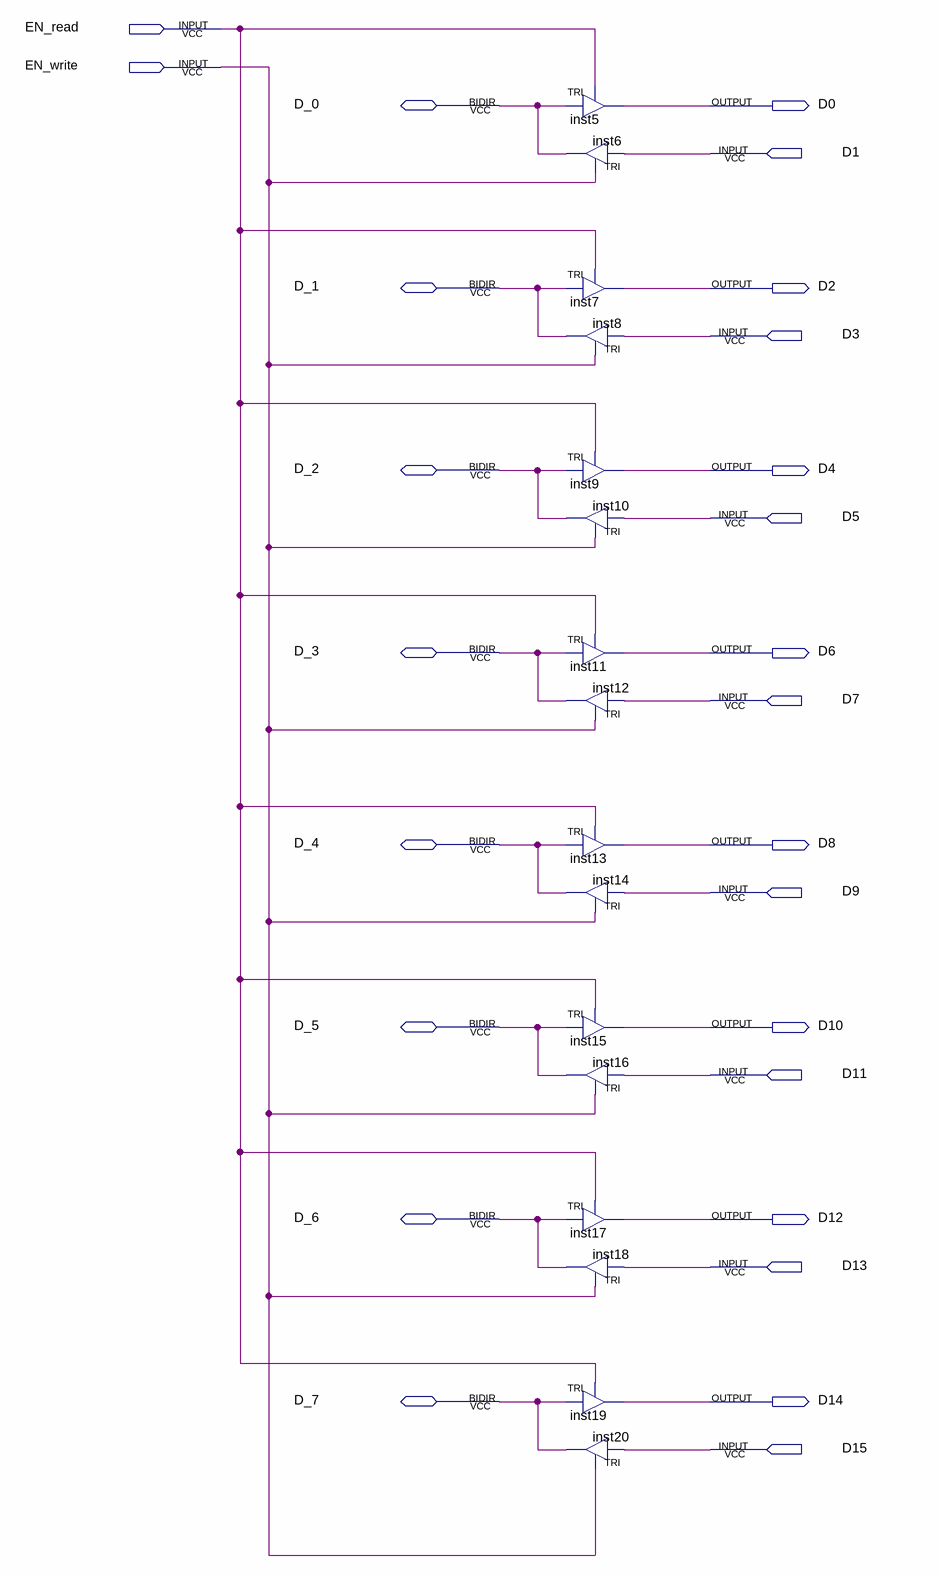
[diagram p0: schematic sheet]
// Quartus schematic santaixuantong.bdf as structural Verilog: 16 symbols, 26 pins
module santaixuantong (
  input  EN_read,
  input  EN_write,
  input  D1,
  input  D3,
  input  D5,
  input  D7,
  input  D9,
  input  D11,
  input  D13,
  input  D15,
  inout  D_0,
  inout  D_1,
  inout  D_2,
  inout  D_3,
  inout  D_4,
  inout  D_5,
  inout  D_6,
  inout  D_7,
  output D0,
  output D2,
  output D4,
  output D6,
  output D8,
  output D10,
  output D12,
  output D14
);

  TRI inst5 (.IN(D_0), .OE(EN_read), .OUT(D0));
  TRI inst6 (.IN(D1), .OE(EN_write), .OUT(D_0));
  TRI inst7 (.IN(D_1), .OE(EN_read), .OUT(D2));
  TRI inst8 (.IN(D3), .OE(EN_write), .OUT(D_1));
  TRI inst9 (.IN(D_2), .OE(EN_read), .OUT(D4));
  TRI inst10 (.IN(D5), .OE(EN_write), .OUT(D_2));
  TRI inst11 (.IN(D_3), .OE(EN_read), .OUT(D6));
  TRI inst12 (.IN(D7), .OE(EN_write), .OUT(D_3));
  TRI inst13 (.IN(D_4), .OE(EN_read), .OUT(D8));
  TRI inst14 (.IN(D9), .OE(EN_write), .OUT(D_4));
  TRI inst15 (.IN(D_5), .OE(EN_read), .OUT(D10));
  TRI inst16 (.IN(D11), .OE(EN_write), .OUT(D_5));
  TRI inst17 (.IN(D_6), .OE(EN_read), .OUT(D12));
  TRI inst18 (.IN(D13), .OE(EN_write), .OUT(D_6));
  TRI inst19 (.IN(D_7), .OE(EN_read), .OUT(D14));
  TRI inst20 (.IN(D15), .OE(EN_write), .OUT(D_7));
endmodule
